# EAGLE design nixie_test_v2 (EAGLE 6.1)
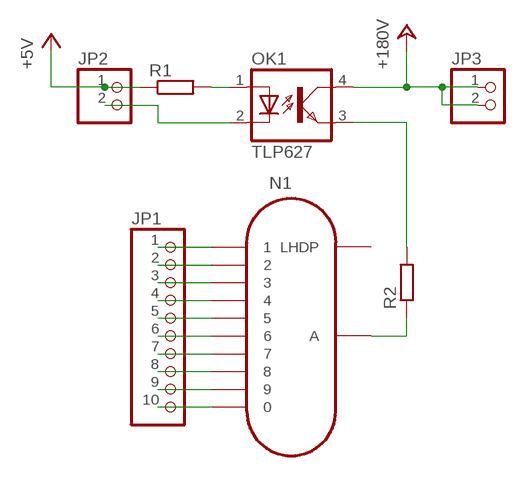
[diagram p0: schematic, sheet 1]

## Parts
JP1  PINHD-1X10  [1X10]
JP2  PINHD-1X2  [1X02]
JP3  PINHD-1X2  [1X02]
N1  IN-12B  [IN-12]
OK1  TLP627  [4-SMD]
R1  R-EU_R0805  [R0805]
R2  R-EU_10  [0207/10]

## Nets
+5V: JP2.1 R1.1
+24V: JP3.1 JP3.2 OK1.4(COL) ; supply symbol labelled +180V
C0: JP1.10 N1.0
C1: JP1.1 N1.1
C2: JP1.2 N1.2
C3: JP1.3 N1.3
C4: JP1.4 N1.4
C5: JP1.5 N1.5
C6: JP1.6 N1.6
C7: JP1.7 N1.7
C8: JP1.8 N1.8
C9: JP1.9 N1.9
N$2: JP2.2 OK1.2(C)
N$17: N1.A R2.1
N$18: OK1.3(EMIT) R2.2
N$23: OK1.1(A) R1.2
Unconnected: N1.LHDP

## Library data of the parts
JP1 = nixie_tube:PINHD-1X10: PIN HEADER
JP2 JP3 = nixie_tube:PINHD-1X2: PIN HEADER
N1 = nixie_tube:IN-12B: IN-12B: medium numeric topview nixie tube
OK1 = nixie_tube:TLP627: TOSHIBA PHOTOCOUPLER GaAs IRED & PHOTO-TRANSISTOR Source: http://www.semicon.toshiba.co.jp/td/en/Opto/Photocoupler/en_20050928_TLP283_datasheet.pdf; OC_FARNELL: unknown; OC_NEWARK: unknown
R1 R2 = nixie_tube:R-EU_: RESISTOR, European symbol

## Board
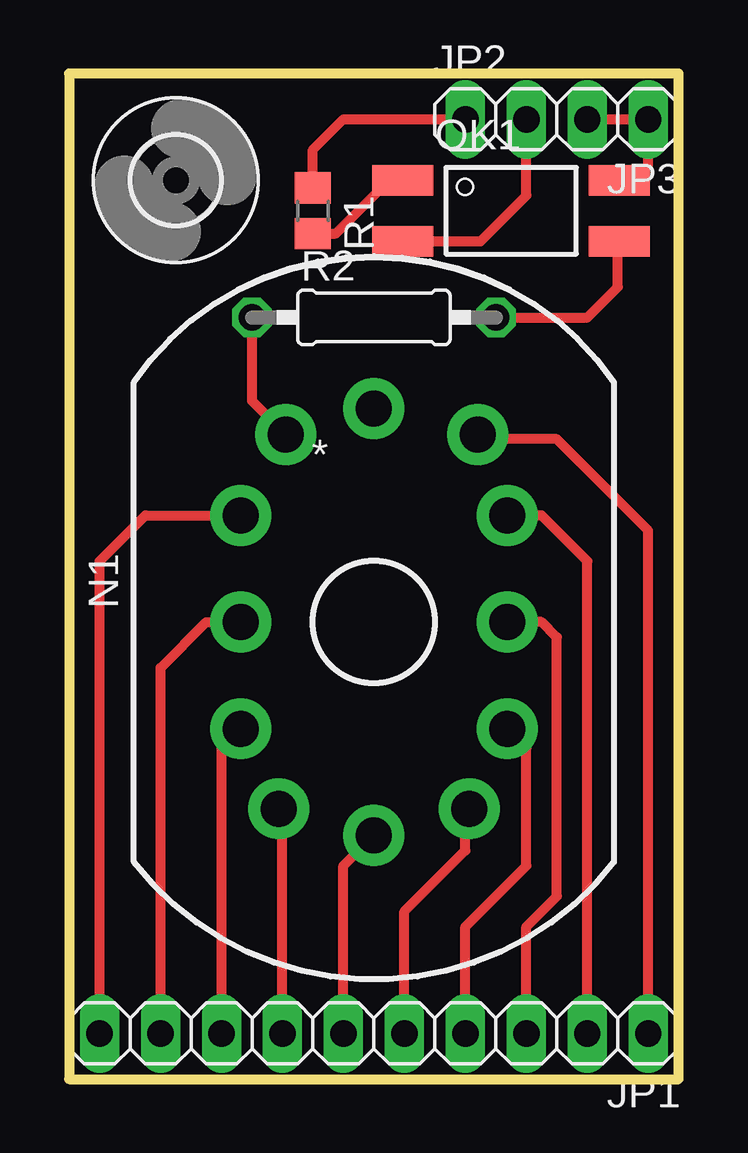
[diagram p1: board, top side]

Size 25.4 x 41.91 mm. Coordinates in mm from the lower left corner, seen from the top.
Outline: 0,0 25.4,0 25.4,41.91 0,41.91 0,0
Copper layers (1*16): Top 0.035mm / dielectric 1.5mm / Bottom 0.035mm
Design rules: minimum track width 10mil, minimum drill 24mil, track to track 8mil, track to pad 8mil, pad to pad 8mil, via to via 8mil, smd to smd 8mil, copper to edge 40mil, drill to drill 8mil, minimum pad ring 10mil, minimum via ring 8mil, stop-mask expansion 4mil, vias tented up to drill 0mil, thermal gap 10mil

### Footprints (pad centres in the part's own frame; a part is rotated, then mirrored left to right if it is on the bottom)
1X10 = drill 1.1 long: 1 -11.43,0; 2 -8.89,0; 3 -6.35,0; 4 -3.81,0; 5 -1.27,0; 6 1.27,0; 7 3.81,0; 8 6.35,0; 9 8.89,0; 10 11.43,0
1X02 = drill 1.1 long: 1 -1.27,0; 2 1.27,0
IN-12 = drill 1.5 pad 2.54: 0 5.556,-4.445; 1 -4.317,-7.817; 2 -5.556,-4.445; 3 -5.556,0; 4 -5.556,4.445; 5 -3.969,7.779; 6 0,8.89; 7 3.969,7.779; 8 5.556,4.445; 9 5.556,0; A 3.683,-7.817; LHDP 0,-8.89 | hole 5: 0,0
4-SMD = smd 2.54 x 1.27: 1 -4.51,1.27; 2 -4.51,-1.27; 3 4.51,-1.27; 4 4.51,1.27
R0805 = smd 1.3 x 1.5: 1 -0.95,0; 2 0.95,0
0207/10 = drill 1.1 octagon: 1 -5.08,0; 2 5.08,0
3,6 = hole 3.6: 0,0

### Placement (x,y rotation side)
JP1  12.7,1.91 180 top
JP2  17.78,40.01 0 top
JP3  22.86,40.01 180 top
N1  12.7,19.05 180 top
OK1  18.41,36.2 0 top
R1  10.16,36.2 270 top
R2  12.7,31.75 0 top
U$1  [3,6]  4.45,37.47 0 top

### Tracks (layer width: path | path; a pad name or v marks a point on that pad's centre or on a via)
+5V
  Top 0.406: R1.1 10.16,38.73 11.43,40.01 JP2.1
+24V
  Top 0.406: OK1.4 23.5,37.47 24.13,38.1 JP3.1 JP3.2
C0
  Top 0.406: JP1.10 1.27,21.59 3.17,23.5 N1.0
C1
  Top 0.406: JP1.1 24.13,22.86 20.32,26.67 17.21,26.67 N1.1
C2
  Top 0.406: JP1.2 21.59,21.59 19.68,23.5 N1.2
C3
  Top 0.406: JP1.3 19.05,6.35 20.32,7.62 20.32,18.41 19.68,19.05 N1.3
C4
  Top 0.406: JP1.4 16.51,6.35 19.05,8.89 19.05,13.81 N1.4
C5
  Top 0.406: JP1.5 13.97,6.99 16.51,9.53 16.51,11.43 N1.5
C6
  Top 0.406: JP1.6 11.43,8.89 N1.6
C7
  Top 0.406: JP1.7 8.89,11.11 N1.7
C8
  Top 0.406: JP1.8 6.35,13.81 N1.8
C9
  Top 0.406: JP1.9 3.81,17.14 5.71,19.05 N1.9
N$2
  Top 0.406: OK1.2 17.14,34.92 19.05,36.83 JP2.2
N$17
  Top 0.406: N1.A 7.62,28.27 R2.1
N$18
  Top 0.406: R2.2 21.59,31.75 22.86,33.02 22.86,34.86 OK1.3
N$23
  Top 0.406: OK1.1 13.34,37.47 11.12,35.24 R1.2